# EAGLE design reflow_controller_v2_eagle7 (EAGLE 7.7.0)
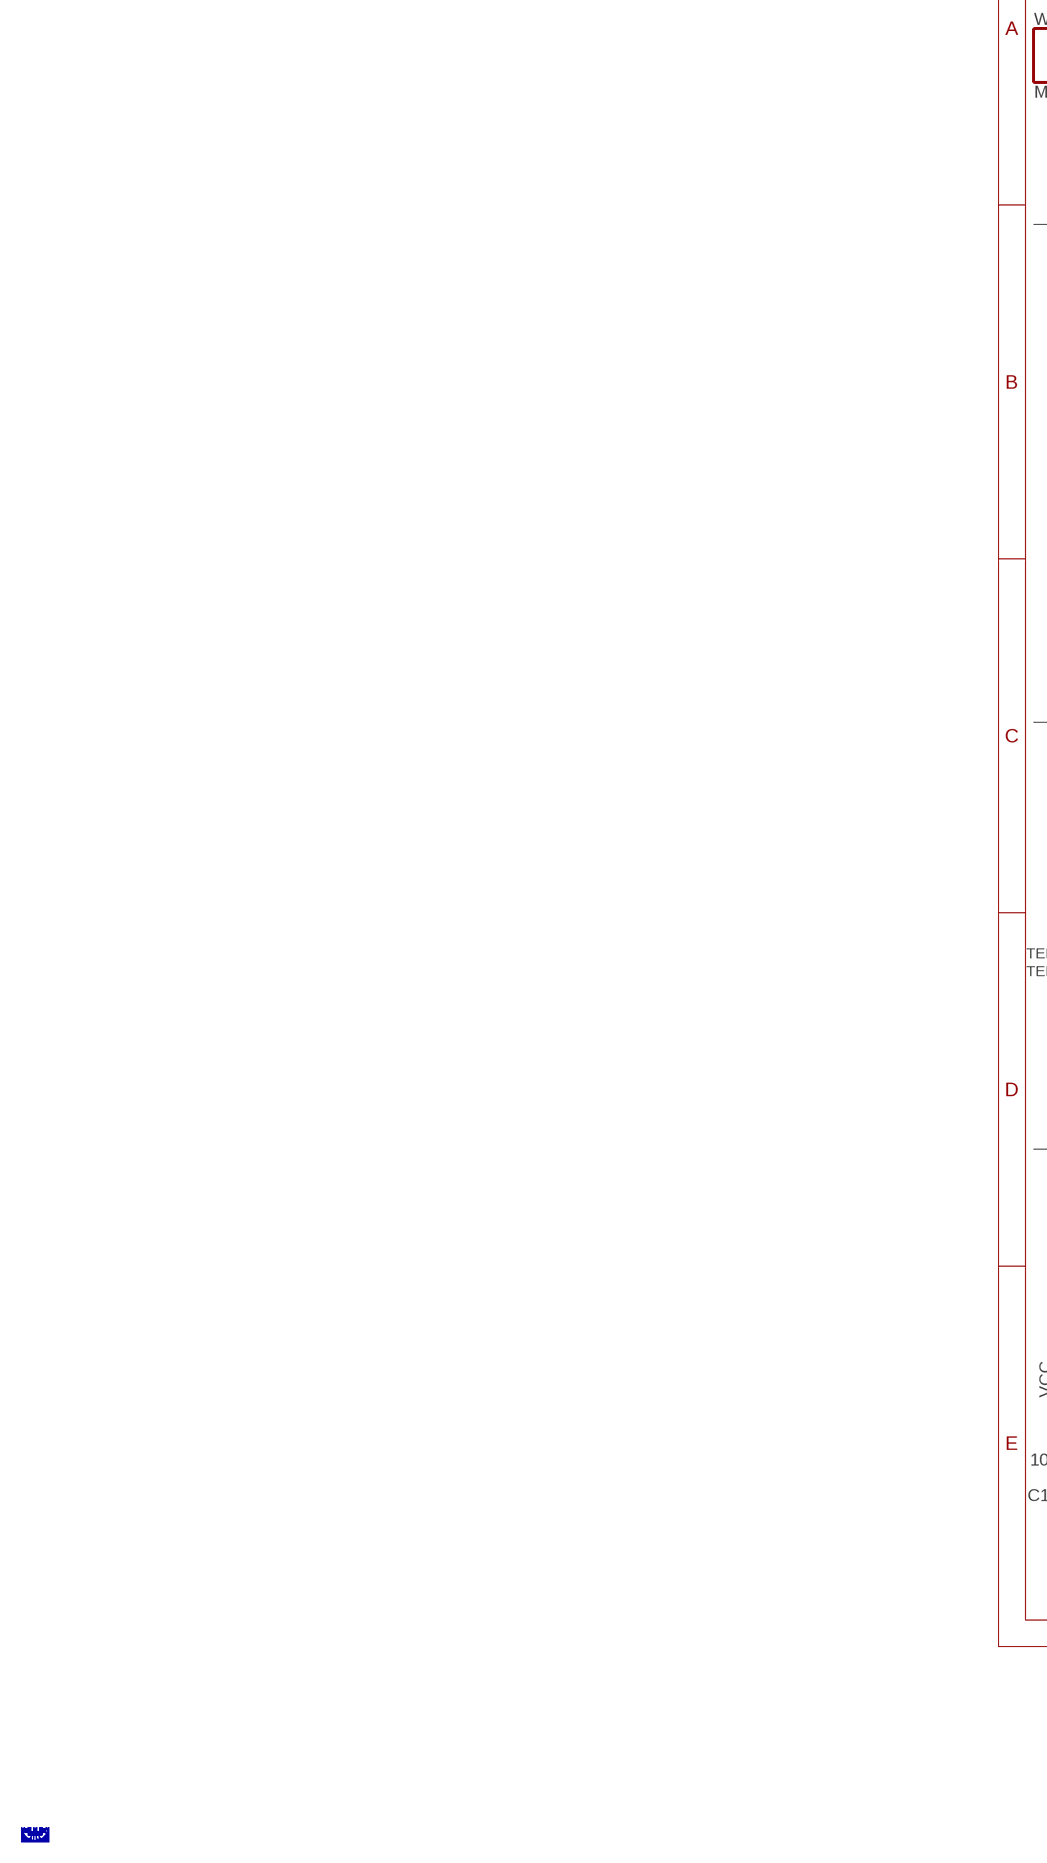
[diagram p0: schematic, sheet 1, part 1 of 2]
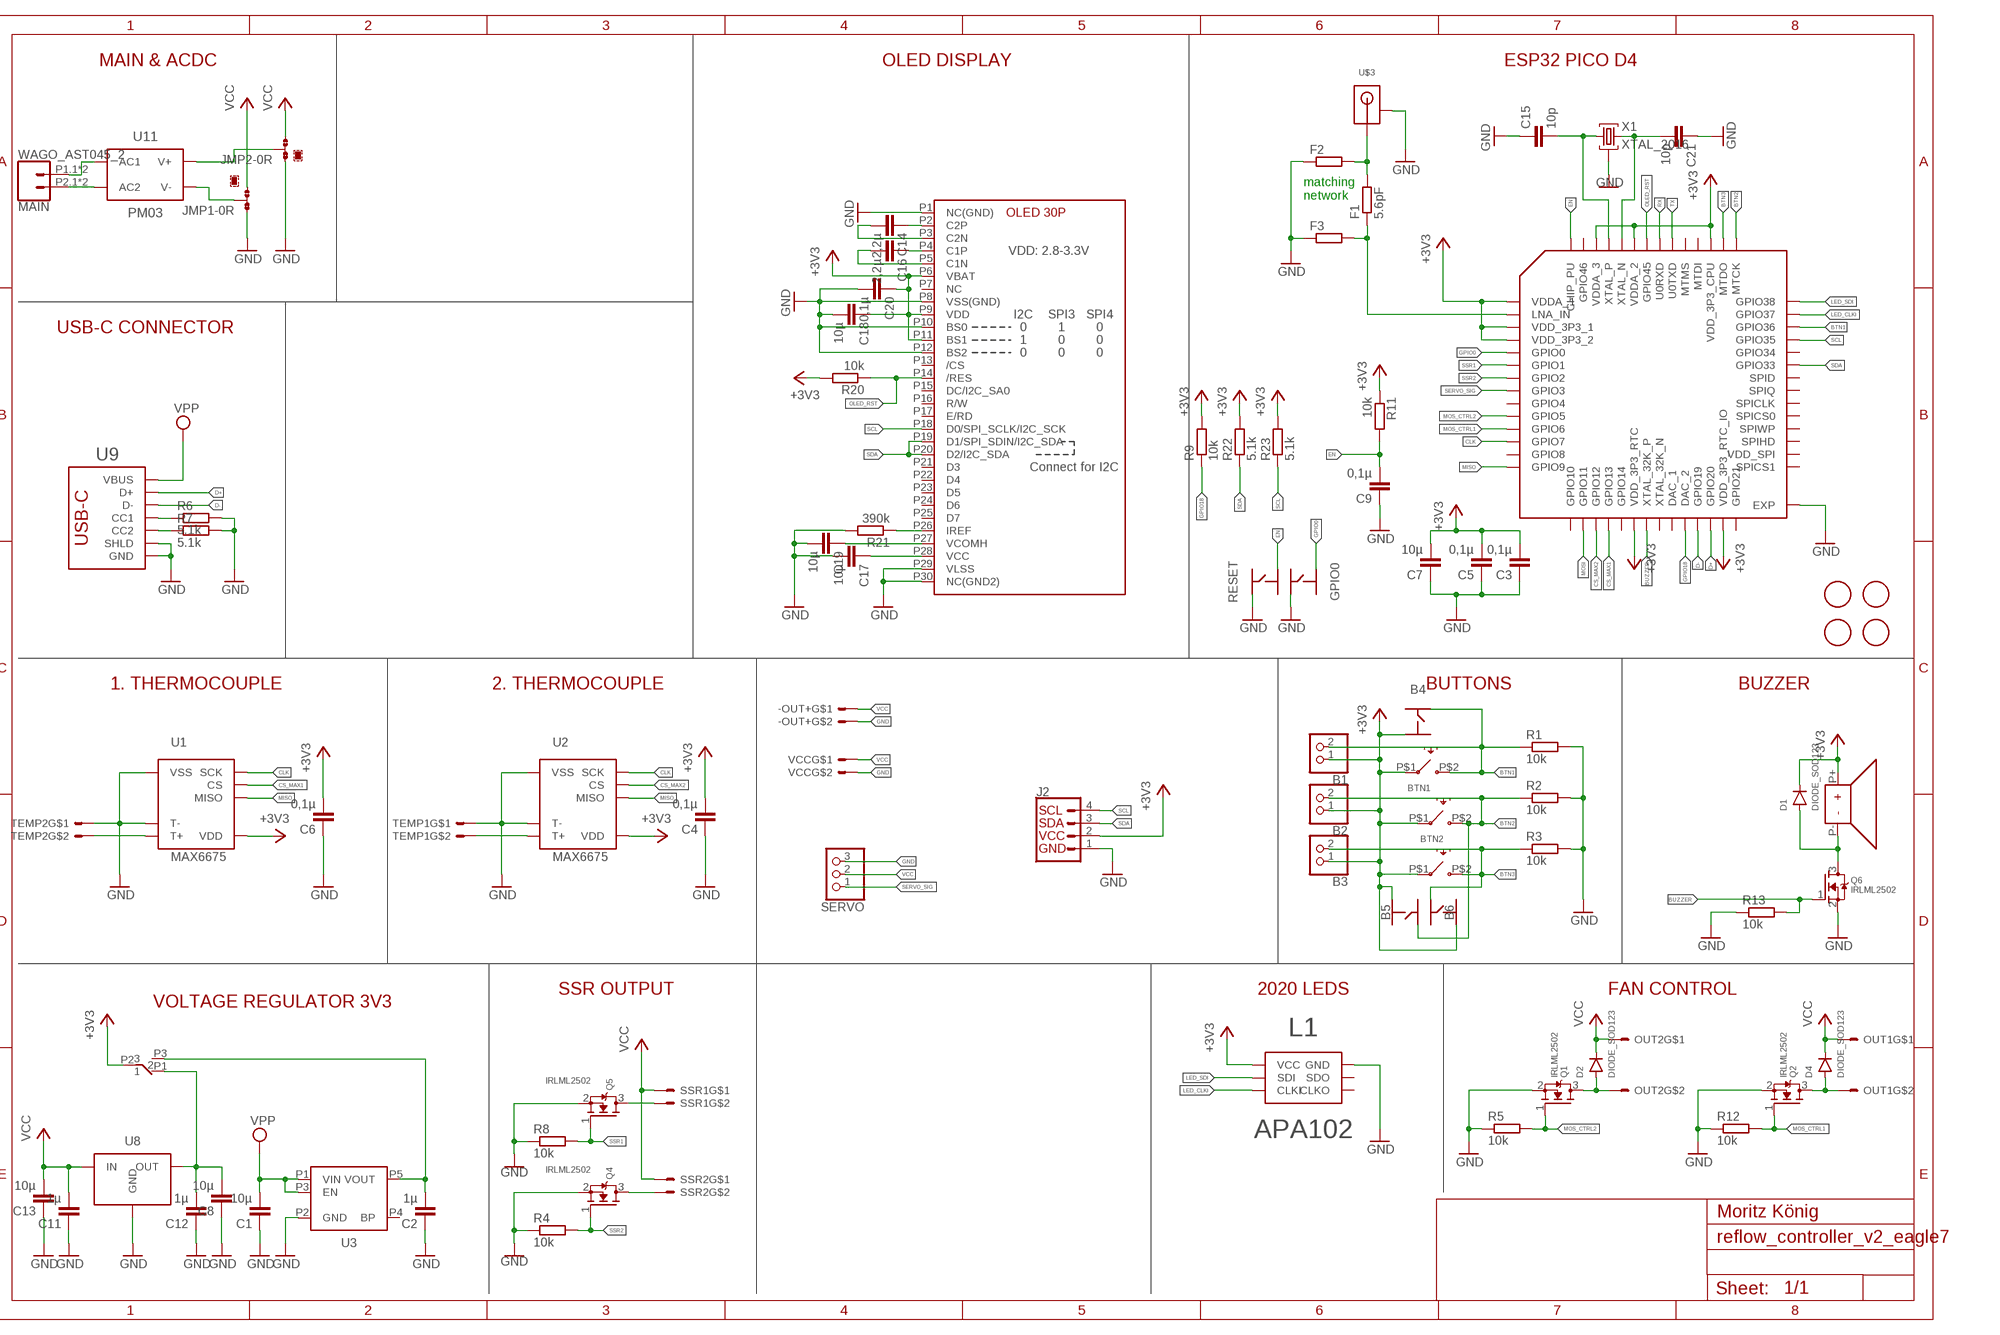
[diagram p1: schematic, sheet 1, part 2 of 2]

## Parts
-OUT+  MOLEX_2MM_2P  [MOLEX_2MM_2P]
B1  PINHD-1X02_2.00  [1X02M]
B2  PINHD-1X02_2.00  [1X02M]
B3  PINHD-1X02_2.00  [1X02M]
B4  BUTTON_4PIN_TS-1070A  [BUTTON_WHITE_SMD]
B5  BUTTON_4PIN_TS-1070A  [BUTTON_WHITE_SMD]
B6  BUTTON_4PIN_TS-1070A  [BUTTON_WHITE_SMD]
BTN1  BUTTON_6X6_SILICON  [BUTTON_SILICON]
BTN2  BUTTON_6X6_SILICON  [BUTTON_SILICON]
BTN3  BUTTON_6X6_SILICON  [BUTTON_SILICON]
C1  10µ  C-EU_WO_KEEPOUT  [C0603]
C2  1µ  C-EU_WO_KEEPOUT  [C0603]
C3  0,1µ  C-EU_WO_KEEPOUT  [C0603]
C4  0,1µ  C-EUC0603  [C0603]
C5  0,1µ  C-EU_WO_KEEPOUT  [C0603]
C6  0,1µ  C-EUC0603  [C0603]
C7  10µ  C-EU_WO_KEEPOUT  [C0603]
C8  10µ  C-EU_WO_KEEPOUT  [C0603]
C9  0,1µ  C-EU_WO_KEEPOUT  [C0603]
C11  1µ  C-EU_WO_KEEPOUT  [C0603]
C12  1µ  C-EU_WO_KEEPOUT  [C0603]
C13  10µ  C-EU_WO_KEEPOUT  [C0603]
C14  2,2µ  C-EU_WO_KEEPOUT  [C0603]
C15  10p  C-EU_WO_KEEPOUT  [C0603]
C16  2,2µ  C-EU_WO_KEEPOUT  [C0603]
C17  10µ  C-EU_WO_KEEPOUT  [C0603]
C18  10µ  C-EU_WO_KEEPOUT  [C0603]
C19  10µ  C-EU_WO_KEEPOUT  [C0603]
C20  0,1µ  C-EU_WO_KEEPOUT  [C0603]
C21  10p  C-EU_WO_KEEPOUT  [C0603]
D1  DIODE_SOD123  [SOD123]
D2  DIODE_SOD123  [SOD123]
D4  DIODE_SOD123  [SOD123]
ESP  ESP32_S2_QFN56_NEW  [QFN56_7X7]
F1  5.6pF  R-EU-0402-WOKEEPOUT  [R0402]
F2  R-EU-0402-WOKEEPOUT  [R0402]
F3  R-EU-0402-WOKEEPOUT  [R0402]
GPIO0  BUTTON_4PIN_TS_1177  [TS-1177-C-B-B]
J2  QWIIC_CONNECTORJS-1MM  [1X04_1MM_RA]
JMP1  0R-JUMPA  [A0R-JMP]
JMP2  0R-JUMPA  [A0R-JMP]
L1  APA102_2020  [APA102_2020]
MAIN  WAGO_AST045_2  [WAGO_AST045_2]
OUT1  MOLEX_2MM_2P  [MOLEX_2MM_2P]
OUT2  MOLEX_2MM_2P  [MOLEX_2MM_2P]
Q1  IRLML2502  [SOT23]
Q2  IRLML2502  [SOT23]
Q4  IRLML2502  [SOT23]
Q5  IRLML2502  [SOT23]
Q6  IRLML2502  [SOT23]
R1  10k  R-EU_WO_KEEPOUT  [R0603]
R2  10k  R-EU_WO_KEEPOUT  [R0603]
R3  10k  R-EU_WO_KEEPOUT  [R0603]
R4  10k  R-EU_WO_KEEPOUT  [R0603]
R5  10k  R-EU_WO_KEEPOUT  [R0603]
R6  5.1k  R-EU_WO_KEEPOUT  [R0603]
R7  5.1k  R-EU_WO_KEEPOUT  [R0603]
R8  10k  R-EU_WO_KEEPOUT  [R0603]
R9  10k  R-EU_WO_KEEPOUT  [R0603]
R11  10k  R-EU_WO_KEEPOUT  [R0603]
R12  10k  R-EU_WO_KEEPOUT  [R0603]
R13  10k  R-EU_WO_KEEPOUT  [R0603]
R20  10k  R-EU_WO_KEEPOUT  [R0603]
R21  390k  R-EU_WO_KEEPOUT  [R0603]
R22  5.1k  R-EU_WO_KEEPOUT  [R0603]
R23  5.1k  R-EU_WO_KEEPOUT  [R0603]
RESET  BUTTON_4PIN_TS_1177  [TS-1177-C-B-B]
S1  SWITCH_MS-22C01-G010  [MS-22C01-G010]
SERVO  PINHD-1X03_2.54  [1X03]
SSR1  MOLEX_2MM_2P  [MOLEX_2MM_2P]
SSR2  MOLEX_2MM_2P  [MOLEX_2MM_2P]
TEMP1  MOLEX_2MM_2P  [MOLEX_2MM_2P]
TEMP2  MOLEX_2MM_2P  [MOLEX_2MM_2P]
U1  MAX6675  [SO8]
U2  MAX6675  [SO8]
U3  RT9193_SC70-5  [SC-70-5]
U4  OLD_096_SSD1306_30P_2B  [OLED_096_30P_B]
U8  LM1117  [SOT223]
U9  USB_C_C393939  [USBC_C393939]
U10  MLT-5030-BUZZER  [MLT-5030-BUZZER]
U11  HILINK_PM03  [HILINK_PM03]
U$1  FIDUCIAL  [FIDUCIAL_1MM]
U$2  FIDUCIAL  [FIDUCIAL_1MM]
U$3  UFL_ANT_CONNECTOR  [UFL_ANT_CONNECTOR]
U$4  FIDUCIAL  [FIDUCIAL_1MM]
U$5  FIDUCIAL  [FIDUCIAL_1MM]
VCC  MOLEX_2MM_2P  [MOLEX_2MM_2P]
X1  XTAL_2016  [XTYL_2016]

## Nets
+3V3: B1.1 B2.1 B3.1 B4.P$2 B5.P$2 B6.P$2 BTN1.P$1(P1) BTN2.P$1(P1) BTN3.P$1(P1) C3.2 C4.2 C5.2 C6.2 C7.2 C18.1 C20.1 D1.P$2(C) ESP.1(VDDA_1) ESP.3(VDD_3P3_1) ESP.4(VDD_3P3_2) ESP.20(VDD_3P3_RTC) ESP.27(VDD_3P3_RTC_IO) ESP.45(VDD_3P3_CPU) ESP.51(VDDA_2) ESP.54(VDDA_3) J2.2(VCC) L1.P1(VCC) L1.P1.1(VCC) R9.2 R11.1 R20.2 R22.2 R23.2 S1.P2 U1.4(VDD) U2.4(VDD) U4.P6(VBAT) U4.P9(VDD) U4.P11(BS1) U10.P+
ANTENNA1: F1.2 F2.2 U$3.ANT
BTN1: B1.2 B4.P$4 BTN1.P$2(P2) ESP.40(GPIO36) R1.1
BTN2: B2.2 B5.P$4 BTN2.P$2(P2) ESP.43(MTCK) R2.1
BTN3: B3.2 B6.P$4 BTN3.P$2(P2) ESP.44(MTDO) R3.1
BUZZER: ESP.21(XTAL_32K_P) Q6.1(G) R13.2
CLK: ESP.12(GPIO7) U1.5(SCK) U2.5(SCK)
CS_MAX1: ESP.18(GPIO13) U1.6(CS)
CS_MAX2: ESP.17(GPIO12) U2.6(CS)
D+: ESP.26(GPIO20) U9.A6(D+) U9.B6(D+)
D-: ESP.25(GPIO19) U9.A7(D-) U9.B7(D-)
EN: C9.2 ESP.56(CHIP_PU) R11.2 RESET.P4
GND: -OUT+.2 C1.1 C2.1 C3.1 C4.1 C5.1 C6.1 C7.1 C8.1 C9.1 C11.1 C12.1 C13.1 C15.1 C17.2 C18.2 C19.2 C20.2 C21.1 ESP.57(EXP) F2.1 F3.1 GPIO0.P1 J2.1(GND) JMP1.1 JMP2.1 L1.P6(GND) L1.P6.1(GND) Q1.2(S) Q2.2(S) Q4.2(S) Q5.2(S) Q6.2(S) R1.2 R2.2 R3.2 R4.1 R5.1 R6.2 R7.2 R8.1 R12.1 R13.1 R21.2 RESET.P1 SERVO.3 TEMP1.1 TEMP2.1 U1.1(VSS) U1.2(T-) U2.1(VSS) U2.2(T-) U3.P2(GND) U4.P1(NC(GND)) U4.P8(VSS(GND)) U4.P10(BS0) U4.P12(BS2) U4.P29(VLSS) U4.P30(NC(GND2)) U8.1(GND) U9.A1B12(GND) U9.B1A12(GND) U9.S1(SHLD) U9.S2(SHLD) U9.S3(SHLD) U9.S4(SHLD) U$3.P1.-(GND) U$3.P2.-(GND) VCC.2 X1.P2(G) X1.P4(G)
GPIO0: ESP.5(GPIO0) GPIO0.P4
GPIO18: ESP.24(DAC_2) R9.1
LED_CLKI: ESP.41(GPIO37) L1.P5(CLKI)
LED_SDI: ESP.42(GPIO38) L1.P4(SDI)
MISO: ESP.14(GPIO9) U1.7(MISO) U2.7(MISO)
MOS_CTRL1: ESP.11(GPIO6) Q2.1(G) R12.2
MOS_CTRL2: ESP.10(GPIO5) Q1.1(G) R5.2
MOSI: ESP.16(GPIO11)
N$1: MAIN.P1.1 MAIN.P1.2 U11.AC1
N$2: TEMP2.2 U1.3(T+)
N$3: MAIN.P2.1 MAIN.P2.2 U11.AC2
N$4: ESP.2(LNA_IN) F1.1 F3.2
N$5: D2.P$1(A) OUT2.2 Q1.3(D)
N$6: D1.P$1(A) Q6.3(D) U10.P-
N$7: D4.P$1(A) OUT1.2 Q2.3(D)
N$9: Q4.3(D) SSR2.2
N$10: Q5.3(D) SSR1.2
N$11: C15.2 ESP.53(XTAL_P) X1.P1
N$12: C21.2 ESP.52(XTAL_N) X1.P3
N$14: TEMP1.2 U2.3(T+)
N$15: JMP2.2 U11.V+
N$16: C8.2 C12.2 S1.P1 U8.2(OUT) U8.4(OUT)
N$17: C14.1 U4.P2(C2P)
N$18: R7.1 U9.B5(CC2)
N$19: C14.2 U4.P3(C2N)
N$20: C16.2 U4.P5(C1N)
N$21: R21.1 U4.P26(IREF)
N$22: C2.2 S1.P3 U3.P5(VOUT)
N$23: JMP1.2 U11.V-
N$25: R6.1 U9.A5(CC1)
N$31: C16.1 U4.P4(C1P)
N$32: C17.1 U4.P28(VCC)
N$33: C19.1 U4.P27(VCOMH)
OLED_RST: ESP.50(GPIO45) R20.1 U4.P14(/RES)
RX: ESP.49(U0RXD)
SCL: ESP.39(GPIO35) J2.4(SCL) R23.1 U4.P18(D0/SPI_SCLK/I2C_SCK)
SDA: ESP.37(GPIO33) J2.3(SDA) R22.1 U4.P19(D1/SPI_SDIN/I2C_SDA) U4.P20(D2/I2C_SDA)
SERVO_SIG: ESP.8(GPIO3) SERVO.1
SSR1: ESP.6(GPIO1) Q5.1(G) R8.2
SSR2: ESP.7(GPIO2) Q4.1(G) R4.2
TX: ESP.48(U0TXD)
VCC: -OUT+.1 C11.2 C13.2 D2.P$2(C) D4.P$2(C) JMP1.3 JMP2.3 OUT1.1 OUT2.1 SERVO.2 SSR1.1 SSR2.1 U8.3(IN) VCC.1
VPP: C1.2 U3.P1(VIN) U3.P3(EN) U9.A4B9(VBUS) U9.B4A9(VBUS)
Unconnected: B4.P$1 B4.P$3 B5.P$1 B5.P$3 B6.P$1 B6.P$3 ESP.9(GPIO4) ESP.13(GPIO8) ESP.15(GPIO10) ESP.19(GPIO14) ESP.22(XTAL_32K_N) ESP.23(DAC_1) ESP.28(GPIO21) ESP.29(SPICS1) ESP.30(VDD_SPI) ESP.31(SPIHD) ESP.32(SPIWP) ESP.33(SPICS0) ESP.34(SPICLK) ESP.35(SPIQ) ESP.36(SPID) ESP.38(GPIO34) ESP.46(MTDI) ESP.47(MTMS) ESP.55(GPIO46) GPIO0.P2 GPIO0.P3 L1.P2(CLKO) L1.P3(SDO) RESET.P2 RESET.P3 U3.P4(BP) U4.P7(NC) U4.P13(/CS) U4.P15(DC/I2C_SA0) U4.P16(R/W) U4.P17(E/RD) U4.P21(D3) U4.P22(D4) U4.P23(D5) U4.P24(D6) U4.P25(D7)

## Notes on the sheet
- MAIN & ACDC | OLED DISPLAY | ESP32 PICO D4
- matching
  network
- USB-C CONNECTOR
- 1. THERMOCOUPLE | 2. THERMOCOUPLE | BUTTONS | BUZZER
- SSR OUTPUT | 2020 LEDS | FAN CONTROL
- VOLTAGE REGULATOR 3V3
- Moritz König

## Library data of the parts
-OUT+ OUT1 OUT2 SSR1 SSR2 TEMP1 TEMP2 VCC = iml_apollo:MOLEX_2MM_2P
B1-B3 = pinhead-2:PINHD-1X02: PIN HEADER
B4-B6 GPIO0 RESET = moekoe:BUTTON_4PIN
BTN1-BTN3 = moekoe:BUTTON_6X6_SILICON
C1-C3 C5 C7-C9 C11-C21 = moekoe:C-EU_WO_KEEPOUT
C4 C6 = rcl:C-EU: CAPACITOR, European symbol; SPICEPREFIX: C
D1 D2 D4 = moekoe:DIODE_SOD123
ESP = moekoe:ESP32_S2_QFN56
F1-F3 = moekoe:R-EU-0402-WOKEEPOUT
J2 = SparkFun-Connectors:QWIIC_CONNECTOR: SparkFun I2C Standard Qwiic Connector An SMD 1mm pitch JST connector makes it easy and quick (get it? Qwiic?) to connect I2C devices to each other. The Qwiic system <http://www.sparkfun.com/qwiic> enables fast and solderless connection between popular platforms and various sensors and actuators. We carry 200mm <https://www.sparkfun.com/products/14204>, 100mm <https://www.sparkfun.com/products/14205>, 50mm <https://www.sparkfun.com/products/14206>, and breadboard friendly <https://www.sparkfun.com/products/14207> Qwiic cables. We also offer 10 pcs strips <https://www.sparkfun.com/products/14323> the SMD connectors.
JMP1 JMP2 = jump-0r-smd:0R-JUMP: SMD 0R 0805 Jumper
L1 = moekoe:APA102_2020
MAIN = moekoe:WAGO_AST045_2
Q1 Q2 Q4-Q6 = moekoe:IRLML2502
R1-R9 R11-R13 R20-R23 = moekoe:R-EU_WO_KEEPOUT
S1 = moekoe:SWITCH_MS-22C01-G010
SERVO = pinhead-2:PINHD-1X03: PIN HEADER
U1 U2 = moekoe:MAX6675
U3 = moekoe:RT9193_SC70-5
U4 = moekoe:OLD_096_SSD1306_30P
U8 = moekoe:LM1117
U9 = moekoe:USB_C_C393939
U10 = moekoe:MLT-5030-BUZZER
U11 = moekoe:HILINK_PM03
U$1 U$2 U$4 U$5 = adafruit:FIDUCIAL: For use by pick and place machines to calibrate the vision/machine, 1mm By microbuilder.eu
U$3 = moekoe:UFL_ANT_CONNECTOR
X1 = moekoe:XTAL_2016

## Board
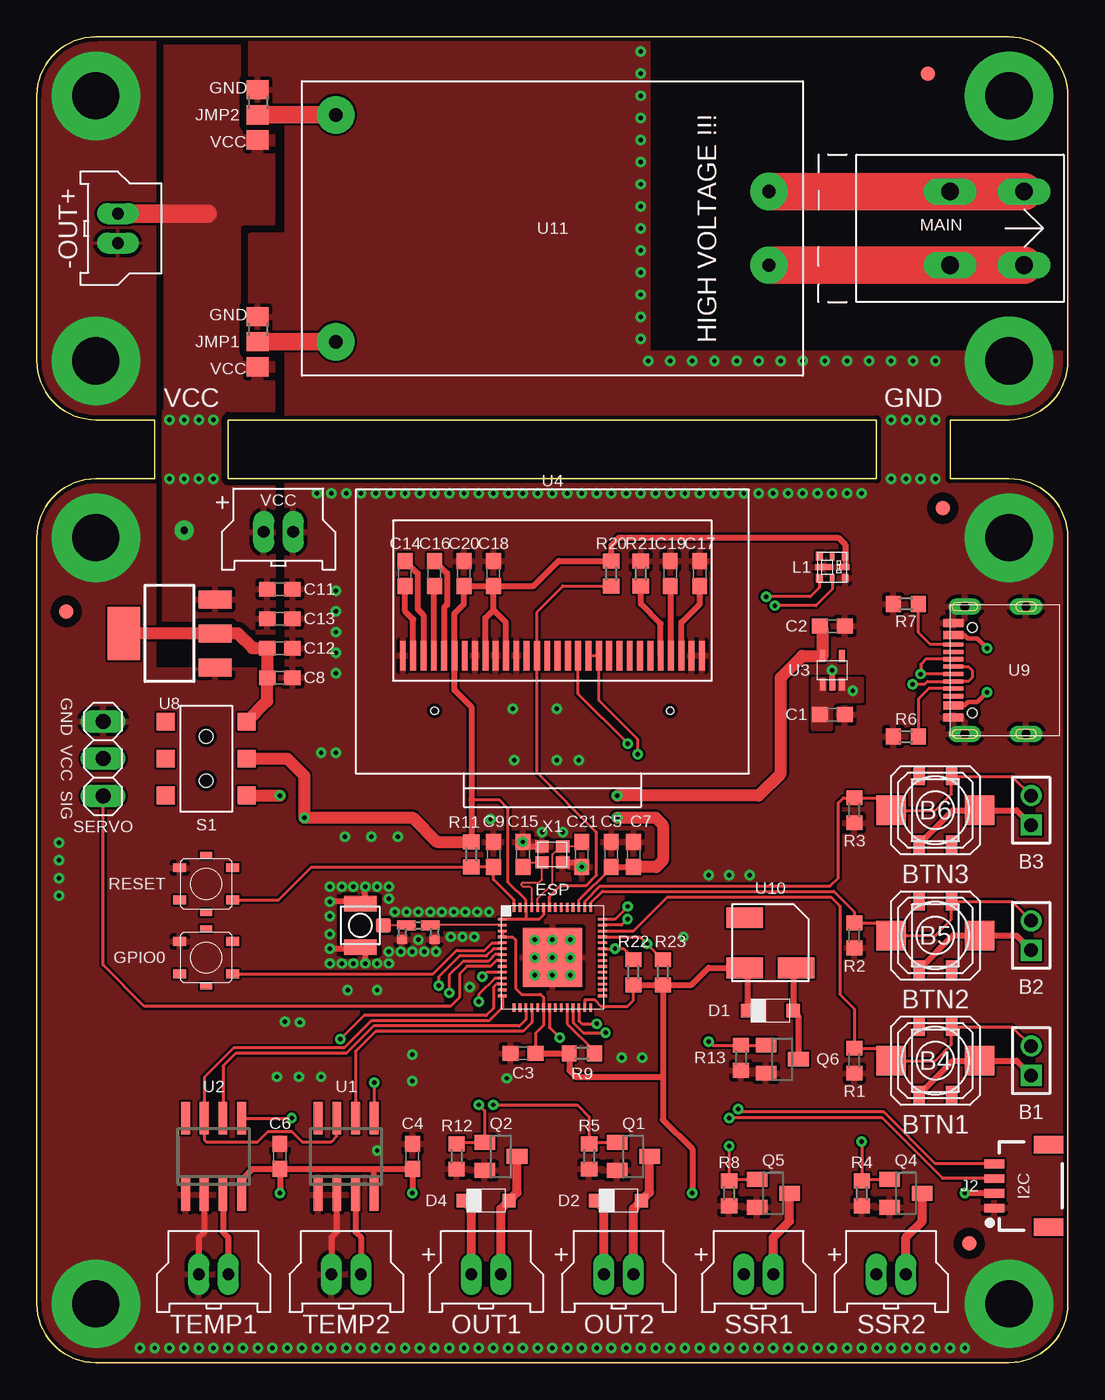
[diagram p2: board, top side]
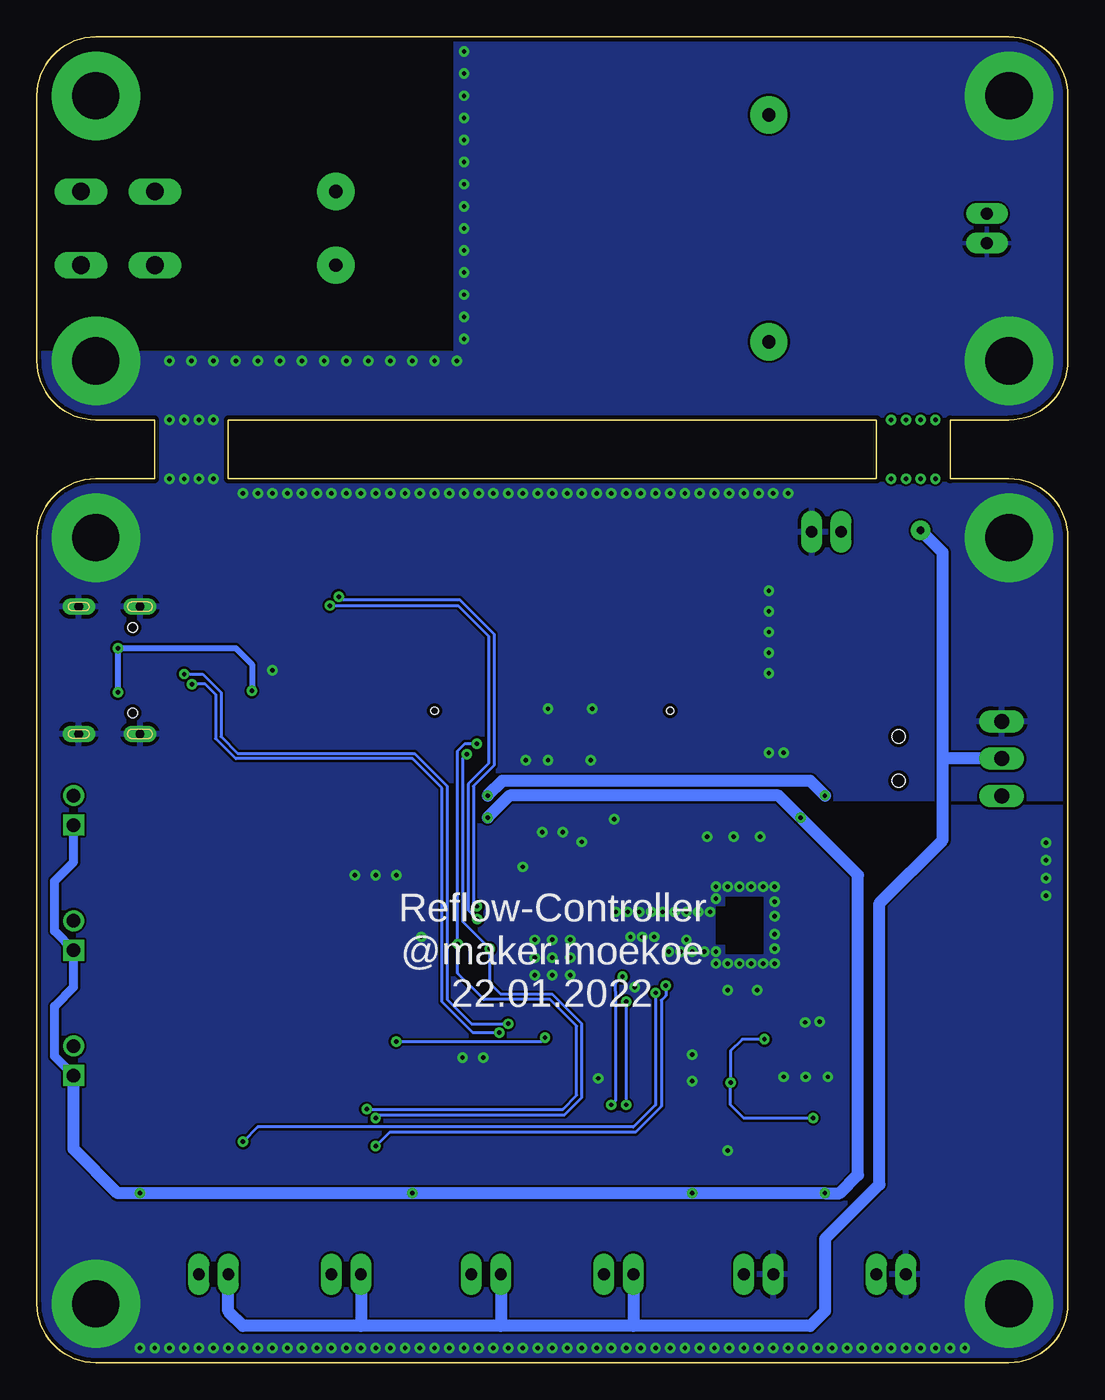
[diagram p3: board, bottom side, seen from below]

Size 70 x 90 mm. Coordinates in mm from the lower left corner, seen from the top.
Outline: 0,68 0,86 arc-90 4,90 66,90 arc-90 70,86 70,68 arc-90 66,64 62,64 62,60 66,60 arc-90 70,56 70,4 arc-90 66,0 4,0 arc-90 0,4 0,56 arc-90 4,60 8,60 8,64 4,64 arc-90 0,68
Outline: 13,64 57,64 57,60 13,60 13,64
Copper layers (1*16): Top 0.035mm / dielectric 1.5mm / Bottom 0.035mm
Design rules "default *": minimum track width 6mil, minimum drill 0.3mm, track to track 6mil, track to pad 6mil, pad to pad 6mil, via to via 6mil, smd to smd 6mil, copper to edge 10mil, drill to drill 6mil, minimum pad ring 10mil, minimum via ring 8mil, stop-mask expansion 0mil, vias tented up to drill 0.5mm, thermal gap 10mil
tRestrict: area 20.4,27.6 to 23.4,31.8; area 23.2,29.3 to 31.1,30.2
bRestrict: area -2,38 to 19,38

### Footprints (pad centres in the part's own frame; a part is rotated, then mirrored left to right if it is on the bottom)
MOLEX_2MM_2P = drill 0.8 pad 1.422 long: 1 -1,0; 2 1,0
1X02M = drill 0.914 square: 1 -1,0 | drill 0.914: 2 1,0
BUTTON_WHITE_SMD = smd 1.2 x 0.8: P$1 2.3,1.1; P$2 2.3,-1.1; P$3 -2.3,-1.1; P$4 -2.3,1.1
BUTTON_SILICON = smd 2 x 2: P$1 -3,0; P$2 3,0
C0603 = smd 1.1 x 1: 1 -0.85,0; 2 0.85,0
SOD123 = smd 0.9 x 0.9: P$1 -1.55,0; P$2 1.55,0
QFN56_7X7 = smd 0.6 x 0.18: 1 -3.4,2.6; 2 -3.4,2.2; 3 -3.4,1.8; 4 -3.4,1.4; 5 -3.4,1; 6 -3.4,0.6; 7 -3.4,0.2; 8 -3.4,-0.2; 9 -3.4,-0.6; 10 -3.4,-1; 11 -3.4,-1.4; 12 -3.4,-1.8; 13 -3.4,-2.2; 14 -3.4,-2.6; 29 3.4,-2.6; 30 3.4,-2.2; 31 3.4,-1.8; 32 3.4,-1.4; 33 3.4,-1; 34 3.4,-0.6; 35 3.4,-0.2; 36 3.4,0.2; 37 3.4,0.6; 38 3.4,1; 39 3.4,1.4; 40 3.4,1.8; 41 3.4,2.2; 42 3.4,2.6 | smd 0.18 x 0.6: 15 -2.6,-3.4; 16 -2.2,-3.4; 17 -1.8,-3.4; 18 -1.4,-3.4; 19 -1,-3.4; 20 -0.6,-3.4; 21 -0.2,-3.4; 22 0.2,-3.4; 23 0.6,-3.4; 24 1,-3.4; 25 1.4,-3.4; 26 1.8,-3.4; 27 2.2,-3.4; 28 2.6,-3.4; 43 2.6,3.4; 44 2.2,3.4; 45 1.8,3.4; 46 1.4,3.4; 47 1,3.4; 48 0.6,3.4; 49 0.2,3.4; 50 -0.2,3.4; 51 -0.6,3.4; 52 -1,3.4; 53 -1.4,3.4; 54 -1.8,3.4; 55 -2.2,3.4; 56 -2.6,3.4 | smd 4 x 4: 57 0,0
R0402 = smd 0.6 x 0.7: 1 -0.5,0; 2 0.5,0
TS-1177-C-B-B = smd 0.9 x 0.6: P1 -1.8,1.1; P2 1.8,1.1; P3 -1.8,-1.1; P4 1.8,-1.1 | smd 0.8 x 0.45: P$5 0,1.95; P$6 0,-1.95
1X04_1MM_RA = smd 0.6 x 1.35: 1 -1.5,0; 2 -0.5,0; 3 0.5,0; 4 1.5,0 | smd 1.2 x 2: NC1 2.8,-3.675; NC2 -2.8,-3.675
A0R-JMP = smd 1.5 x 1.3: 1 0,1.7; 2 0,0; 3 0,-1.7
APA102_2020 = smd 0.6 x 0.45: P1 -0.75,0.875; P3 -0.75,-0.875; P4 0.75,-0.875; P6 0.75,0.875 | smd 0.4 x 0.7: P1.1 0,0.8 | smd 0.6 x 0.3: P2 -0.75,0; P5 0.75,0 | smd 0.4 x 1.1: P6.1 0,-0.6
WAGO_AST045_2 = drill 1.2 long: P1.1 -2.5,2.51; P1.2 -2.5,-2.51; P2.1 2.5,2.51; P2.2 2.5,-2.51
SOT23 = smd 1 x 1.4: 1 -0.95,-1.1; 2 0.95,-1.1; 3 0,1.1
R0603 = smd 1 x 1.1: 1 -0.85,0; 2 0.85,0
MS-22C01-G010 = smd 1.2 x 1.2: P1 -2.5,2.75; P2 0,2.75; P3 2.5,2.75; P4 -2.5,-2.75; P5 0,-2.75; P6 2.5,-2.75 | hole 0.9: -1.5,0; 1.5,0
1X03 = drill 1.016 long: 1 -2.54,0; 2 0,0; 3 2.54,0
SO8 = smd 0.6 x 2.2: 1 -1.905,-2.6; 2 -0.635,-2.6; 3 0.635,-2.6; 4 1.905,-2.6; 5 1.905,2.6; 6 0.635,2.6; 7 -0.635,2.6; 8 -1.905,2.6
SC-70-5 = smd 0.4 x 0.8: P1 0.65,0.97; P2 0,0.97; P3 -0.65,0.97; P4 -0.65,-0.97; P5 0.65,-0.97
OLED_096_30P_B = smd 0.4 x 2: P1 -10.15,20; P2 -9.45,20; P3 -8.75,20; P4 -8.05,20; P5 -7.35,20; P6 -6.65,20; P7 -5.95,20; P8 -5.25,20; P9 -4.55,20; P10 -3.85,20; P11 -3.15,20; P12 -2.45,20; P13 -1.75,20; P14 -1.05,20; P15 -0.35,20; P16 0.35,20; P17 1.05,20; P18 1.75,20; P19 2.45,20; P20 3.15,20; P21 3.85,20; P22 4.55,20; P23 5.25,20; P24 5.95,20; P25 6.65,20; P26 7.35,20; P27 8.05,20; P28 8.75,20; P29 9.45,20; P30 10.15,20 | hole 0.5: -8,16.25; 8,16.25
SOT223 = smd 1.219 x 2.235: 1 -2.311,-3.099; 2 0,-3.099; 3 2.311,-3.099 | smd 3.6 x 2.2: 4 0,3.099
USBC_C393939 = smd 0.55 x 1.35: A1B12 -3.2,0.775; A4B9 -2.4,0.775; B1A12 3.2,0.775; B4A9 2.4,0.775 | smd 0.275 x 1.35: A5 -1.25,0.775; A6 -0.25,0.775; A7 0.25,0.775; B5 1.75,0.775; B6 0.75,0.775; B7 -0.75,0.775; B8 1.25,0.775 | smd 0.3 x 1.35: A8 -1.75,0.775 | drill 0.6 pad 1 long: S1 -4.32,0; S2 4.32,0; S3 -4.32,-4.15; S4 4.32,-4.15 | hole 0.65: 2.89,-0.5; -2.89,-0.5
MLT-5030-BUZZER = smd 1.4 x 2.5: NC -1.7,-1.75; P+ 1.7,-1.75; P- 1.7,1.75
HILINK_PM03 = drill 0.9 pad 2.54: AC1 -14.7,2.5; AC2 -14.7,-2.5; V+ 14.7,-7.7; V- 14.7,7.7
FIDUCIAL_1MM = smd 1 x 1: 1 0,0
UFL_ANT_CONNECTOR = smd 1 x 1: ANT 0,1.55 | smd 1.05 x 2.2: P1.- -1.475,0; P2.- 1.475,0
XTYL_2016 = smd 0.9 x 0.8: P1 -0.7,-0.55; P2 0.7,-0.55; P3 0.7,0.55; P4 -0.7,0.55

### Placement (x,y rotation side)
-OUT+  5.5,77 270 top
B1  67.5,20.5 90 top
B2  67.5,29 90 top
B3  67.5,37.5 90 top
B4  61,20.5 270 top
B5  61,29 270 top
B6  61,37.5 270 top
BTN1  61,20.5 180 top
BTN2  61,29 180 top
BTN3  61,37.5 180 top
C1  54,44 180 top
C2  54,50 180 top
C3  33,21 0 top
C4  25.5,14 270 top
C5  39,34.5 270 top
C6  16.5,14 270 top
C7  40.5,34.5 270 top
C8  16.5,46.5 180 top
C9  31,34.5 270 top
C11  16.5,52.5 180 top
C12  16.5,48.5 180 top
C13  16.5,50.5 180 top
C14  25,53.57 90 top
C15  33,34.5 270 top
C16  27,53.57 90 top
C17  45,53.57 90 top
C18  31,53.57 90 top
C19  43,53.57 90 top
C20  29,53.57 90 top
C21  37,34.5 90 top
D1  49.8,23.9 180 top
D2  39.5,11 180 top
D4  30.5,11 180 top
ESP  35,27.5 0 top
F1  25.9,29.68 180 top
F2  24.8,29.22 90 top
F3  27,29.22 90 top
GPIO0  11.5,27.5 0 top
J2  65,12 90 top
JMP1  15,69.3 0 top
JMP2  15,84.7 0 top
L1  54,54 270 top
MAIN  64.5,77 90 top
OUT1  30.5,6 0 top
OUT2  39.5,6 0 top
Q1  40.5,14 270 top
Q2  31.5,14 270 top
Q4  59,11.5 270 top
Q5  50,11.5 270 top
Q6  50.6,20.6 270 top
R1  55.5,20.5 270 top
R2  55.5,29 270 top
R3  55.5,37.5 270 top
R4  56,11.5 90 top
R5  37.5,14 90 top
R6  59,42.5 180 top
R7  59,51.5 180 top
R8  47,11.5 90 top
R9  37,21 180 top
R11  29.5,34.5 270 top
R12  28.5,14 90 top
R13  47.8,20.7 90 top
R20  39,53.57 90 top
R21  41,53.57 90 top
R22  40.5,26.5 270 top
R23  42.5,26.5 270 top
RESET  11.5,32.5 0 top
S1  11.5,41 270 top
SERVO  4.5,41 90 top
SSR1  49,6 0 top
SSR2  58,6 0 top
TEMP1  12,6 0 top
TEMP2  21,6 0 top
U1  21,14 0 top
U2  12,14 0 top
U3  54,47 180 top
U4  35,28 0 top
U8  9,49.5 90 top
U9  63,47 90 top
U10  49.8,28.5 270 top
U11  35,77 180 top
U$1  60.5,87.5 0 top
U$2  61.5,58 0 top
U$3  21.96,29.68 270 top
U$4  2,51 0 top
U$5  63.3,8.1 0 top
VCC  16.4,56.4 0 top
X1  35,34.5 0 top

### Tracks (layer width: path | path; a pad name or v marks a point on that pad's centre or on a via)
+3V3  (via drill 0.3)
  Top 0.2: C3.2 33.85,22.35 34.4,22.9 ESP.20 34.4,24.8 34.2,25 32.9,25 32.5,25.4 32.5,28.7 32.3,28.9 ESP.4 ESP.3 | R22.2 40.5,24.6 40.1,24.2 38.3,24.2 37.85,24.65 37.25,24.65 37.2,24.6 ESP.27 | ESP.45 36.8,31.4 39,33.6 C5.2 | 29.5,38.2 31.4,38.2 32,37.6 32,32.6 33.2,31.4 ESP.54 33.2,30.1 | ESP.51 34.4,30.4 34.1,30.1 33.2,30.1 | 33.2,30.1 ESP.1
  Top 0.4: C18.1 C20.1 29,51.5 28.35,50.85 U4.P6 28.35,45.65 29.5,44.5 29.5,38.2 R11.1 | C18.1 33.72,52.72 35.42,54.42 R20.2 39,55.5 39.5,56 54.4,56 54.88,55.52 L1.P1 54.88,54.08 L1.P1.1 | U4.P9 30.45,50.55 31,51.1 | 31,51.1 C18.1 | U4.P11 31.85,50.25 31,51.1 | U2.4 13.9,12.4 14.65,13.15 C6.2 | C6.2 23,13.15 | 23,13.15 C4.2 v25.5,11.5 | U1.4 22.91,13.05 23,13.15 | B3.1 66.5,37.5 BTN3.P$1 62.2,37.5 B6.P$2 | B2.1 66.5,29 BTN2.P$1 62.2,29 B5.P$2 | B1.1 66.5,20.5 BTN1.P$1 62.2,20.5 B4.P$2 | C6.2 v16.5,11.5 | J2.2 v63,11.5 | C3.2 R9.2 36.15,19.85 36.6,19.4 42.5,19.4 | R22.2 R23.2 | v44.5,11.5 44.5,14.5 42.5,16.5 42.5,19.4 | R23.2 42.5,19.4 | C5.2 C7.2 | R23.2 44.45,25.65 45.6,26.8 U10.P+ 48.25,26.6 D1.P$2
  Top 0.8: S1.P2 17,41 18.15,39.85 v18.15,37 25.5,37 27.15,35.35 R11.1 | v39.4,37 42,37 42.5,36.5 42.5,34.1 42.05,33.65 C7.2
  Bottom 0.6: B1.1 68.8,20.8 68.8,24.2 67.5,25.5 B2.1 68.8,29.3 68.8,32.7 67.5,34 B3.1
  Bottom 0.8: B1.1 67.5,14.5 64.5,11.5 v63,11.5 v44.5,11.5 v25.5,11.5 v16.5,11.5 15.5,11.5 14.25,12.75 14.25,33.1 v18.15,37 19.65,38.5 37.9,38.5 v39.4,37
ANTENNA1
  Top 0.152: U$3.ANT 23.55,29.72 F2.2 25.36,29.72 F1.2
BTN1
  Top 0.2: B1.2 66.2,22.8 B4.P$4 62.1,21.6 61,20.5 BTN1.P$2 57.15,21.35 R1.1 55.5,24 54.5,25 54.5,31 53.9,31.6 42.8,31.6 40.5,29.3 ESP.40
BTN2
  Top 0.2: B2.2 66.2,31.3 B5.P$4 62.1,30.1 61,29 BTN2.P$2 57.15,29.85 R2.1 55.5,30.6 54.1,32 38.39,32 37.6,31.2 ESP.43
BTN3
  Top 0.2: B3.2 66.2,39.8 B6.P$4 62.1,38.6 61,37.5 BTN3.P$2 57.15,38.35 R3.1 54.75,38.35 54.4,38 54.4,32.9 53.85,32.35 38.25,32.35 37.2,31.3 ESP.44
BUZZER  (via drill 0.3)
  Top 0.2: ESP.21 34.8,22.76 v35.5,22.06 | Q6.1 R13.2 45.85,21.55 v45.6,21.8
  Bottom 0.2: v35.5,22.06 35.77,21.79 45.59,21.79 v45.6,21.8
CLK  (via drill 0.3)
  Top 0.2: ESP.12 31.2,25.7 31,25.5 31,24.06 30.5,23.56 22.2,23.56 v20.61,21.96 | v22.9,19 v22.91,19 U1.5 | U2.5 v17.3,16.6
  Bottom 0.2: v20.61,21.96 22.11,21.96 22.9,21.16 v22.9,19 22.9,17.5 22,16.6 v17.3,16.6
CS_MAX1
  Top 0.2: ESP.18 33.6,23.1 33,22.5 23,22.5 21.64,21.14 U1.6
CS_MAX2
  Top 0.2: ESP.17 33.2,23.3 32.75,22.85 22.85,22.85 21,21 13.5,21 12.63,20.14 U2.6
D+  (via drill 0.3)
  Top 0.2: U9.A6 v60.01,46.75 v60,46.74 60,47.4 60.35,47.75 U9.B6 | ESP.26 36.8,23.2 37,23 v38,23
  Bottom 0.2: v60,46.74 58.74,46.74 57.5,45.5 57.5,42.5 56.35,41.35 44.35,41.35 42.15,39.15 42.15,24.65 40.5,23 v38,23
D-  (via drill 0.3)
  Top 0.2: U9.A7 63.25,47.25 63.5,47 63.5,46.5 63.25,46.25 U9.B7 60.46,46.25 60.28,46.06 v59.47,46.06 | ESP.25 36.4,23.1 37.11,22.39 v38.61,22.39
  Bottom 0.2: v38.61,22.39 40.39,22.39 42.5,24.5 42.5,39 44.5,41 56.5,41 57.87,42.37 57.87,45.37 58.56,46.06 v59.47,46.06
EN
  Top 0.2: ESP.56 32.4,31.4 31,32.8 C9.2 R11.2 18.65,33.65 16.4,31.4 RESET.P4
GND  (via drill 0.3, 3.2 pad 6)
  Top 0.4: U2.2 11.37,8.87 11,8.5 TEMP1.1 | U1.2 20.36,8.87 20,8.5 TEMP2.1 | U3.P2 v54,47 | v19.9,31.3 21.82,31.3 U$3.P1.- 22.3,31.49 v22.3,32.3 | v19.9,28.1 21.86,28.1 U$3.P2.- 22.3,27.87 v22.3,27.1 | X1.P2 36.7,33.95 C21.1 | C15.1 33.3,35.05 X1.P4
  other vias: 58,64 59,64 60,64 61,64 61,68 59.5,68 58,68 56.5,68 55,68 53.5,68 52,68 50.5,68 49,68 47.5,68 46,68 44.5,68 43,68 41.5,68 41,69.5 41,71 41,72.5 41,74 41,75.5 41,77 41,78.5 41,80 41,81.5 41,83 41,84.5 41,86 41,87.5 41,89 66,68 66,56 4,4 66,4 32.4,40.9 32.3,44.4 20.3,52.4 20.3,51 20.3,49.6 20.3,48.2 20.3,46.8 30.7,30.6 29.9,30.6 29.1,30.6 28.3,30.6 27.5,30.6 26.7,30.6 25.9,30.6 25.1,30.6 24.3,30.6 25.9,28.7 29.7,28.9 28.9,28.9 28.1,28.9 27.1,27.9 26.3,27.9 25.5,27.9 24.7,27.9 23.9,27.9 23.9,27.1 23.1,27.1 21.5,27.1 20.7,27.1 19.9,27.1 19.9,29.1 23.1,32.3 23.9,32.3 23.9,31.5 21.5,32.3 20.7,32.3 19.9,32.3 19.9,30.3 23.1,14.4 16.85,23.15 17.85,23.1 35,59 34,59 33,59 32,59 31,59 30,59 29,59 28,59 27,59 26,59 25,59 24,59 23,59 22,59 21,59 20,59 19,59 36,59 37,59 38,59 39,59 40,59 41,59 42,59 43,59 44,59 45,59 46,59 47,59 48,59 49,59 50,59 51,59 52,59 53,59 54,59 55,59 56,59 35,1 34,1 33,1 32,1 31,1 30,1 29,1 28,1 27,1 26,1 25,1 24,1 23,1 22,1 21,1 20,1 19,1 18,1 17,1 16,1 15,1 14,1 13,1 12,1 11,1 10,1 9,1 8,1 7,1 36,1 37,1 38,1 39,1 40,1 41,1 42,1 43,1 44,1 45,1 46,1 47,1 48,1 49,1 50,1 51,1 52,1 53,1 54,1 55,1 56,1 57,1 58,1 59,1 60,1 61,1 62,1 63,1 4,56 35.3,44.4 19.3,41.4 20.3,41.4 30.8,36.9 4,86 4,68 37,33.65 33,35.35 34.3,36 35.7,36 35,27.5 35.3,40.9 36.8,40.9 43.9,28.9 16.3,19.4 17.8,19.4 19.3,19.4 35,28.7 33.8,28.7 33.8,27.5 33.8,26.3 35,26.3 36.2,26.3 36.2,27.5 36.2,28.7 39.7,20.7 41.1,20.7 31.9,19.3 25.5,20.9 25.5,19.1 21.1,25.3 23.1,25.3 22.7,35.7 24.5,35.7 20.9,35.7 1.5,35.3 1.5,34.1 1.5,32.9 1.5,31.7 29.4,25.5 45.6,33.1 47,33.1 48.4,33.1 58,60 59,60 60,60 61,60
  pour Top (rank 2): 14.5,91 14.5,85 17,85 17,76.5 14.5,76.5 14.5,69.5 17,69.5 17,47 -1.5,47 -1.5,-1.5 71.5,-1.5 71.5,68.5 41.5,68.5 41.5,91
  pour Bottom (rank 2): 17,91 17,59.7 -1.5,59.7 -1.5,-1.5 71.5,-1.5 71.5,68.5 41.5,68.5 41.5,91
  pour Top: -1,91 8,91 8,45.5 -1,45.5
  pour Bottom: -3,91.5 18.5,91.5 18.5,63.5 -3,63.5
GPIO0
  Top 0.2: GPIO0.P4 26.9,26.4 28.5,28 30.4,28 30.9,28.5 ESP.5
GPIO18
  Top 0.2: ESP.24 36,23 37.85,21.15 R9.1
LED_CLKI  (via drill 0.3)
  Top 0.2: L1.P5 54,52.5 52.89,51.39 v50.11,51.39 | v40.1,30.1 39.7,29.7 ESP.41
  Bottom 0.2: v50.11,51.39 41.39,51.39 39.32,49.32 39.32,40.68 40.72,39.28 40.72,30.72 v40.1,30.1
LED_SDI  (via drill 0.3)
  Top 0.2: L1.P4 53.12,52.62 52.5,52 v49.5,52 | v40.12,30.97 39.24,30.1 ESP.42
  Bottom 0.2: v49.5,52 49.3,51.8 41.3,51.8 38.97,49.47 38.97,40.53 40.37,39.13 40.37,31.22 v40.12,30.97
MISO
  Top 0.2: ESP.14 31.6,24.11 30.7,23.2 22.71,23.2 20.86,21.35 13.35,21.35 11.37,19.36 U2.7 11.37,15.13 11.5,15 15,15 15.7,15.7 17.3,15.7 18,15 20,15 20.36,15.37 U1.7
MOS_CTRL1  (via drill 0.3)
  Top 0.2: R12.2 28.6,14.95 Q2.1 30.4,17.1 v30,17.5 | ESP.11 31.1,26.1 30,25 v30,24.5
  Bottom 0.2: v30,24.5 v30,17.5
MOS_CTRL2  (via drill 0.3)
  Top 0.2: Q1.1 37.6,14.95 R5.2 37.5,16.7 36.7,17.5 v31,17.5 | ESP.10 30.54,26.5 v30.24,26.2
  Bottom 0.2: v31,17.5 30.7,17.8 30.7,25 30.7,25.2 30.7,25.74 v30.24,26.2
N$1
  Top 2.54: MAIN.P1.2 MAIN.P1.1 U11.AC1
N$2
  Top 0.4: U1.3 21.64,8.87 22,8.5 TEMP2.2
N$3
  Top 2.54: U11.AC2 MAIN.P2.1 MAIN.P2.2
N$4
  Top 0.152: F1.1 26.96,29.68 F3.2 27.01,29.75 27.06,29.7 ESP.2
N$5
  Top 0.6: OUT2.2 40.5,10.45 D2.P$1 41.6,11.55 Q1.3
N$6
  Top 0.4: U10.P- 51.35,26.6 D1.P$1 51.7,23.55 Q6.3
N$7
  Top 0.6: OUT1.2 31.5,10.45 D4.P$1 32.6,11.55 Q2.3
N$9
  Top 0.6: SSR2.2 59,8.5 60.1,9.6 Q4.3
N$10
  Top 0.6: SSR1.2 50,8.5 51.1,9.6 Q5.3
N$11
  Top 0.152: ESP.53 33.6,32.2 33.5,32.3 33,32.3 32.9,32.4 32.9,32.5 33,32.6 34.1,32.6 34.3,32.8 X1.P1 33.3,33.95 C15.2
N$12
  Top 0.152: ESP.52 34,31.5 35,32.5 35,34.5 35.55,35.05 X1.P3 36.7,35.05 C21.2
N$14
  Top 0.4: U2.3 12.63,8.87 13,8.5 TEMP1.2
N$15
  Top 1.2: U11.V+ JMP2.2
N$16
  Top 0.8: S1.P1 15.65,44.9 C8.2 C12.2 14.65,48.5 13.65,49.5 U8.2 U8.4
N$17
  Top 0.4: U4.P2 25.55,50.45 25,51 C14.1
N$18
  Top 0.2: U9.B5 60.65,48.75 59.85,49.55 R7.1
N$19
  Top 0.4: C14.2 25.85,53.57 25.85,51.15 26.25,50.75 U4.P3
N$20
  Top 0.4: C16.2 27.85,53.57 27.85,51.45 27.65,51.25 U4.P5
N$21
  Top 0.4: U4.P26 42.35,50.15 41,51.5 R21.1
N$22  (via drill 0.3)
  Top 0.8: S1.P3 v16.5,38.5 | v39.4,38.5 49,38.5 50.5,40 50.5,46.5 51.97,47.97 U3.P5 53.35,49.8 C2.2
  Bottom 0.8: v16.5,38.5 17.5,39.5 38.4,39.5 v39.4,38.5
N$23
  Top 1.2: U11.V- JMP1.2
N$25
  Top 0.2: U9.A5 60.55,45.75 59.85,45.05 R6.1
N$29  (via drill 3.2 pad 6)
  other vias: 66,86
N$31
  Top 0.4: U4.P4 26.95,52.67 C16.1
N$32
  Top 0.4: U4.P28 43.75,50.25 45,51.5 C17.1
N$33
  Top 0.4: U4.P27 43.05,52.67 C19.1
OLED_RST
  Top 0.2: R20.1 35.72,52.72 33.95,50.95 U4.P14 33.95,40.05 38,36 38,33.1 37.3,32.4 35.56,32.4 34.8,31.64 ESP.50
SCL  (via drill 0.3)
  Top 0.2: ESP.39 40.95,28.9 v41.42,28.43 R23.1 | J2.4 61,13.5 57.49,17.01 47.81,17.01 v47.61,17.21 | v40.12,42.02 36.75,45.39 U4.P18
  Bottom 0.2: v47.61,17.21 34.29,17.21 33.35,18.15 33.35,22.85 35.15,24.65 39.65,24.65 41.42,26.43 v41.42,28.43 41.42,41.53 40.94,42.02 v40.12,42.02
SDA  (via drill 0.3)
  Top 0.2: U4.P19 U4.P20 38.15,44.95 40.8,42.3 v40.8,41.3 | ESP.37 v39.25,28.1 39.85,28.1 40.5,27.45 R22.1 | J2.3 61.5,12.5 57.39,16.61 v47,16.61
  Bottom 0.2: v47,16.61 46.8,16.81 34.19,16.81 33,18 33,23 35,25 38.5,25 39.25,25.75 v39.25,28.1 41.07,29.92 41.07,41.03 v40.8,41.3
SERVO_SIG
  Top 0.2: ESP.8 31.2,27.3 30.8,26.9 29.2,26.9 28.7,26.4 28.7,24.8 28.1,24.2 7.3,24.2 4.5,27 SERVO.1
SSR1  (via drill 0.3)
  Top 0.2: Q5.1 47.1,12.45 R8.2 v47,14.7 | ESP.6 31,28.1 30.51,27.61 28.69,27.61 27.3,26.21 v27.3,25.6
  Bottom 0.2: v47,14.7 46.05,15.65 29.35,15.65 27.6,17.4 27.6,24.6 27.3,24.9 v27.3,25.6
SSR2  (via drill 0.3)
  Top 0.2: Q4.1 56.1,12.45 R4.2 v56,15 | ESP.7 31.1,27.7 30.65,27.25 28.94,27.25 28,26.31 v28,25.1
  Bottom 0.2: v28,25.1 28,17.5 29.5,16 55,16 v56,15
VCC  (via drill 0.3, 0.5 pad 1.3)
  Top 0.6: D4.P$2 29.5,10.45 OUT1.1 | D2.P$2 38.5,10.45 OUT2.1
  Top 1.27: -OUT+.1 11.6,78
  Bottom 0.8: SSR2.1 57,3.5 56,2.5 48,2.5 | 29.5,2.5 17.5,2.5 16.5,3.5 16.5,8.4 12.8,12.1 12.8,31.2 8.5,35.5 8.5,41 | 29.5,2.5 38.5,2.5 | 38.5,2.5 48,2.5 | SSR1.1 48,2.5 | OUT2.1 38.5,2.5 | OUT1.1 29.5,2.5 | 8.5,41 8.5,42.5 | SERVO.2 8.5,41
  Bottom 0.813: 8.5,42.5 8.5,55 v10,56.5
  other vias: 9,64 10,64 11,64 12,64 9,60 10,60 11,60 12,60
  pour Top (isolate 0.4, rank 3): 8.5,64.5 16,64.5 16,49.5 8.5,49.5
  pour Top (isolate 0.5, rank 3): 8.7,63 15.8,63 15.8,91 8.7,91
VPP  (via drill 0.3)
  Top 0.3: U9.B4A9 62.96,49.4 63.2,49.16 63.84,49.16 v64.5,48.5 | U9.A4B9 62.96,44.6 63.2,44.84 63.84,44.84 v64.5,45.5
  Bottom 0.4: v55.4,45.6 55.4,47.4 56.5,48.5 v64.5,48.5 v64.5,45.5
  pour Top (no thermals): 52.7,46.4 52.7,43 53.9,43 53.9,44.6 54.2,44.9 56,44.9 56,46.4

### Text on the board
tPlace: GND / / / VCC | GND / / / VCC | VCC | GND | + | + | + | + | +
bPlace: Reflow-Controller / @maker.moekoe / 22.01.2022
tNames: HIGH VOLTAGE !!! | GND VCC SIG | I2C
tStop: @maker.moekoe